# Altium schematic sheet Inductive_Leveler.SchDoc: Inductive Leveler
size A4; Author: Raúl de Pablos; CompanyName: bq - Mundo Reader; Organization: bq - Mundo Reader; DocumentNumber: 1; Revision: 1.1; SheetNumber: 1; SheetTotal: 1
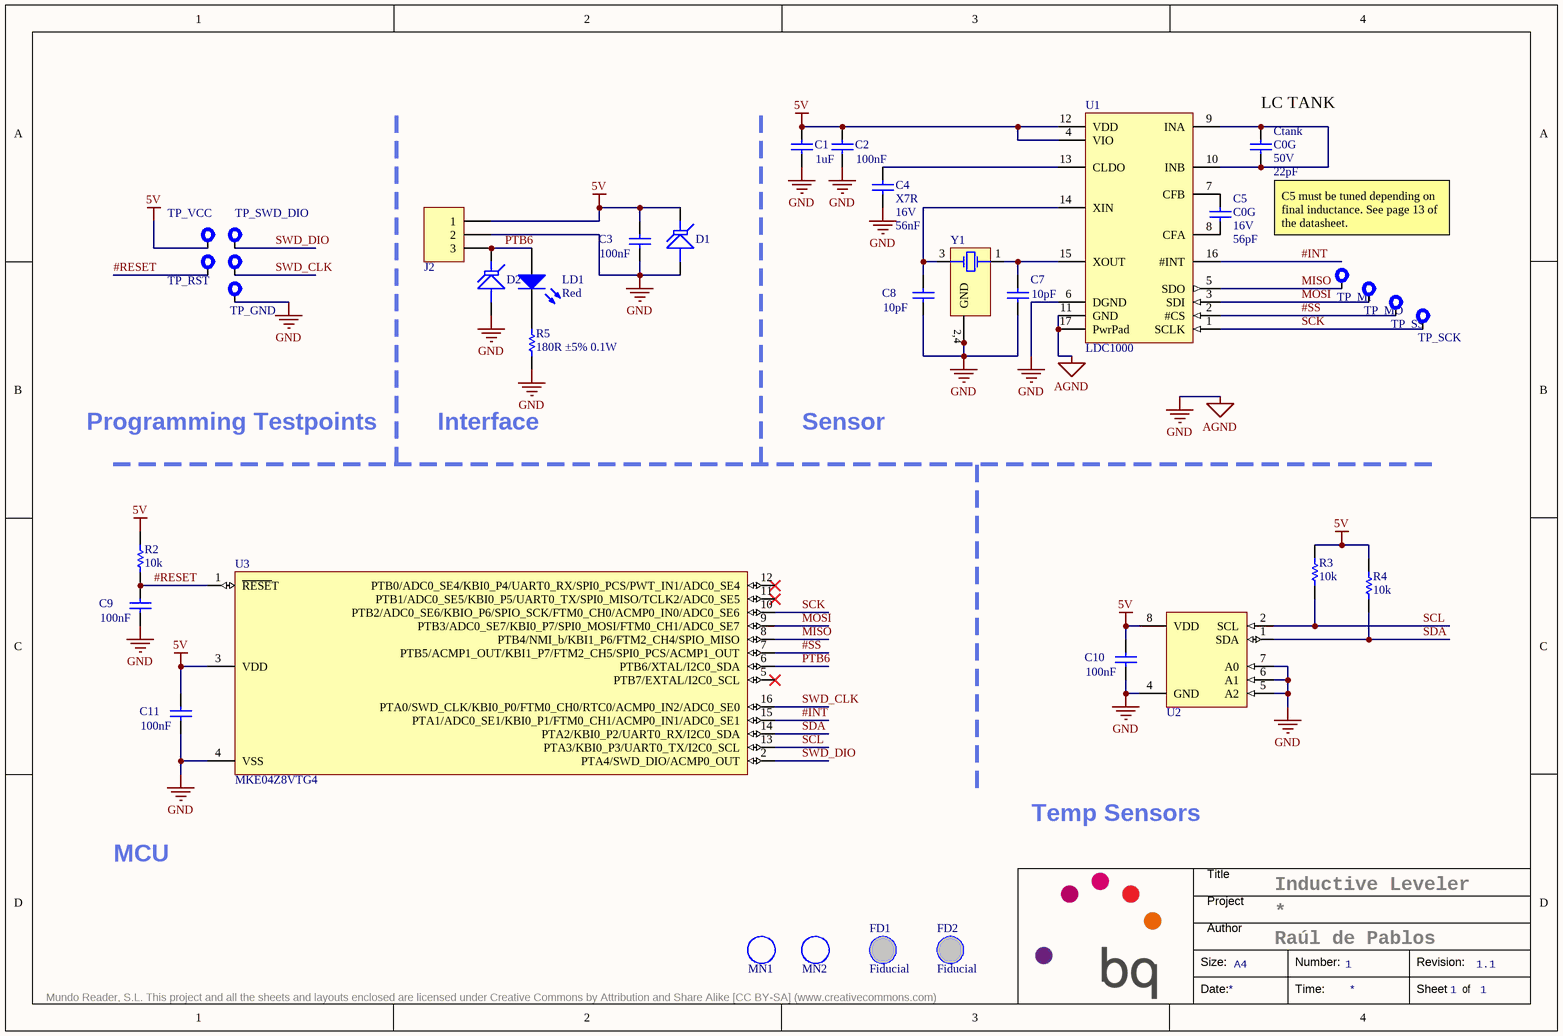
[diagram p0: Inductive_Leveler.SchDoc]

## Parts
C1  Capacitance: 1uF  [C0402]  (hidden comment: Capacitor)
C2  Capacitance: 100nF  [C0402]  (hidden comment: Capacitor)
C3  Capacitance: 100nF  [C0402]  (hidden comment: Capacitor)
C4  Dielectric: X7R  Voltage: 16V  Capacitance: 56nF  [C0402]  (hidden comment: Capacitor)
C5  Dielectric: C0G  Voltage: 16V  Capacitance: 56pF  [C0603]  (hidden comment: Capacitor)
C7  Capacitance: 10pF  [C0402]  (hidden comment: Capacitor)
C8  Capacitance: 10pF  [C0402]  (hidden comment: Capacitor)
C9  Capacitance: 100nF  [C0402]  (hidden comment: Capacitor)
C10  Capacitance: 100nF  [C0402]  (hidden comment: Capacitor)
C11  Capacitance: 100nF  [C0402]  (hidden comment: Capacitor)
Ctank  Dielectric: C0G  Voltage: 50V  Capacitance: 22pF  [C0603]  (hidden comment: Capacitor)
D1  ESD9L5.0ST5G  [SOD923]  (value not drawn)
D2  ESD9L5.0ST5G  [SOD923]  (value not drawn)
FD1  Fiducial  [Fiducial_1mm]  (no BOM)
FD2  Fiducial  [Fiducial_1mm]  (no BOM)
J2  1x3 pin Header 2.54mm  [1x3 Header Angled SMD 2.54]  (value not drawn)
LD1  Red  [LED0603]
MN1  Mounting Nut  [SMTSO-M4-4ET]  (value not drawn)
MN2  Mounting Nut  [SMTSO-M4-4ET]  (value not drawn)
R2  value 10k  [R0402]  (hidden comment: Resistor)
R3  value 10k  [R0402]  (hidden comment: Resistor)
R4  value 10k  [R0402]  (hidden comment: Resistor)
R5  value 180R ±5% 0.1W  [R0603]  (hidden comment: Resistor)
TP_GND  Testpoint  [TP_SMD_1mm]  (value not drawn)  (no BOM)
TP_MI  Testpoint  [TP_SMD_1mm]  (value not drawn)  (no BOM)
TP_MO  Testpoint  [TP_SMD_1mm]  (value not drawn)  (no BOM)
TP_RST  Testpoint  [TP_SMD_1mm]  (value not drawn)  (no BOM)
TP_SCK  Testpoint  [TP_SMD_1mm]  (value not drawn)  (no BOM)
TP_SS  Testpoint  [TP_SMD_1mm]  (value not drawn)  (no BOM)
TP_SWD_CLK  Testpoint  [TP_SMD_1mm]  (value not drawn)  (no BOM)
TP_SWD_DIO  Testpoint  [TP_SMD_1mm]  (value not drawn)  (no BOM)
TP_VCC  Testpoint  [TP_SMD_1mm]  (value not drawn)  (no BOM)
U1  LDC1000  [LDC1000]
U2  TCN75A  [MSOP8]  (value not drawn)
U3  MKE04Z8VTG4  [TSSOP16]
Y1  ABM3B-8.000MHZ-B2-T  [XTAL 5X3.2mm_alternate]  (value not drawn)

## Nets
5V: C1.2 C2.2 C3.2 C10.2 C11.2 D1.K J2.1 R2.2 R3.2 R4.2 TP_VCC.1 U1.4(VIO) U1.12(VDD) U2.8(VDD) U3.3(VDD)
AGND: C1.1 C2.1 C3.1 C4.1 C7.1 C8.1 C9.1 C10.1 C11.1 D1.A D2.A J2.2 R5.1 TP_GND.1 U1.6(DGND) U1.11(GND) U1.17(PwrPad) U2.4(GND) U2.5(A2) U2.6(A1) U2.7(A0) U3.4(VSS) Y1.2(GND) Y1.4(GND)  [also labelled GND]
#INT: U1.16(#INT) U3.15(PTA1/ADC0_SE1/KBI0_P1/FTM0_CH1/ACMP0_IN1/ADC0_SE1)
#RESET: C9.2 R2.1 TP_RST.1 U3.1(~{RESE}T)
#SS: TP_SS.1 U1.2(#CS) U3.7(PTB5/ACMP1_OUT/KBI1_P7/FTM2_CH5/SPI0_PCS/ACMP1_OUT)
MISO: TP_MI.1 U1.5(SDO) U3.8(PTB4/NMI_b/KBI1_P6/FTM2_CH4/SPIO_MISO)
MOSI: TP_MO.1 U1.3(SDI) U3.9(PTB3/ADC0_SE7/KBI0_P7/SPI0_MOSI/FTM0_CH1/ADC0_SE7)
PTB6: D2.K J2.3 LD1.A U3.6(PTB6/XTAL/I2C0_SDA)
SCK: TP_SCK.1 U1.1(SCLK) U3.10(PTB2/ADC0_SE6/KBIO_P6/SPIO_SCK/FTM0_CH0/ACMP0_IN0/ADC0_SE6)
SCL: R3.1 U2.2(SCL) U3.13(PTA3/KBI0_P3/UART0_TX/I2C0_SCL)
SDA: R4.1 U2.1(SDA) U3.14(PTA2/KBI0_P2/UART0_RX/I2C0_SDA)
SWD_CLK: TP_SWD_CLK.1 U3.16(PTA0/SWD_CLK/KBI0_P0/FTM0_CH0/RTC0/ACMP0_IN2/ADC0_SE0)
SWD_DIO: TP_SWD_DIO.1 U3.2(PTA4/SWD_DIO/ACMP0_OUT)
NetC4_2: C4.2 U1.13(CLDO)
NetC5_1: C5.1 U1.8(CFA)
NetC5_2: C5.2 U1.7(CFB)
NetC7_2: C7.2 U1.15(XOUT) Y1.1(OSC1)
NetC8_2: C8.2 U1.14(XIN) Y1.3(OSC2)
NetCtank_1: Ctank.1 Ctank.2 U1.9(INA) U1.10(INB)
NetLD1_K: LD1.K R5.2

Not connected (* = marked no-connect by the designer): U3 5(PTB7/EXTAL/I2C0_SCL)* 11(PTB1/ADC0_SE5/KBI0_P5/UART0_TX/SPI0_MISO/TCLK2/ADC0_SE5)* 12(PTB0/ADC0_SE4/KBI0_P4/UART0_RX/SPI0_PCS/PWT_IN1/ADC0_SE4)*

## Notes on the sheet
- (near Ctank) LC TANK
- C5 must be tuned depending on final inductance. See page 13 of the datasheet.
- Programming Testpoints
- Interface
- Sensor
- Temp Sensors
- MCU
- Title
- Project
- Size:
- Author
- A4
- Number:
- Revision:
- Mundo Reader, S.L. This project and all the sheets and layouts enclosed are licensed under Creative Commons by Attribution and Share Alike [CC BY-SA] (www.creativecommons.com)
- Date:
- Time:
- Sheet
- of
- (in symbol ABM3B 8MHz) 2,4

## Library data of the parts
C1 = C0402_1uF_16V_±10%: Capacitor SMD; Manufacturer: TDK; Tolerance: ±10%; OrderingCode: C1005X5R1C105K050BC; Temp_ Max: 125; Temp_ Min: -55; Value: =Capacitance+' '+Tolerance+' '+Voltage; Part Number: C0402_1uF_16V_±10%
C2 C3 C9-C11 = C0402_100nF_16V_±10%: Capacitor SMD; Manufacturer: Kemet; Tolerance: ±10%; OrderingCode: C0402C104K4RAC; Temp_ Max: 125; Temp_ Min: -55; Value: =Capacitance+' '+Tolerance+' '+Voltage; Part Number: C0402_100nF_16V_±10%
C4 = C0402_56nF_16V_±10%: Capacitor SMD; Manufacturer: Kemet; Value: 56nF ±10% 16V; Tolerance: ±10%; OrderingCode: C0402C563K4RAC; Temp_ Max: 125; Temp_ Min: -55; Part Number: C0402_56nF_16V_±10%
C5 = C0603_56pF_16V_±10%: Capacitor SMD; Manufacturer: Kemet; Value: 56pF ±10% 16V; Tolerance: ±10%; OrderingCode: C0603C560K4GAC; Temp_ Max: 125; Temp_ Min: -55; Part Number: C0603_56pF_16V_±10%
C7 C8 = C0402_10pF_16V_±10%: Capacitor SMD; Manufacturer: Kemet; Tolerance: ±10%; OrderingCode: C0402C100K4GAC; Temp_ Max: 125; Temp_ Min: -55; Value: =Capacitance+' '+Tolerance+' '+Voltage; Part Number: C0402_10pF_16V_±10%
Ctank = C0603_22pF_25V_±10%: Capacitor SMD; Part Number: C0603_22pF_50V_±1%; Manufacturer: AVX; Value: 22pF 1% 50V; Tolerance: 1%; OrderingCode: 06035A220FAT2A; Temp_ Max: 125; Temp_ Min: -55
D1 D2 = TVS 5Vdc Low Cap: Protection, Transient Suppression Diode; Manufacturer: ON Semiconductor; Voltage: 5Vdc; Breakdown Voltage: 5,4Vdc; Overvoltage Current: 1A; Temp_ Max: 125; Temp_ Min: -55; Part Number: TVS 5Vdc Low Cap; OrderingCode: ESD9L5.0ST5G
FD1 FD2 = Fiducial 1mm: Fiducial Mark; Part Number: Fiducial 1mm
J2 = CON_TPH_SMDA2.54_3: Connector, 1x3 pin Header 2.54mm; Manufacturer: Samtec; OrderingCode: TSM-103-01-T-SH; Temp_ Max: 105; Temp_ Min: -55; Value: 3; Pitch: 2.54mm; Pin: 3; Part Number: CON_TPH_SMDA2.54_3
LD1 = LS Q976-NR-1: Light Emitting Diode; Manufacturer: OSRAM Opto; Temp_ Max: 85; Temp_ Min: -40; OrderingCode 2: HSMH-C190; Part Number: LS Q976-NR-1; OrderingCode: LS Q976-NR-1; Manufacturer 2: Avago Technologies; Value: Red
MN1 MN2 = SMTSO-M4-4ET: SMTSO Mounting Nut; Manufacturer: PEM; Part Number: SMTSO-M4-4ET
R2-R4 = R0402_10k_0.063W_±5%: Resistor, SMD; Manufacturer: Vishay; Tolerance: ±5%; OrderingCode: CRCW040210K0JN; Power: 0.063W; Temp_ Max: 155; Temp_ Min: -55; PackageDescription: SMD; Part Number: R0402_10k_0.063W_±5%; Resistance: 10k
R5 = R0603_180R_0.1W_±5%: Resistor, SMD; Manufacturer: Vishay; Tolerance: ±5%; OrderingCode: CRCW0603180RJN; Power: 0.1W; Resistance: 180R; Temp_ Max: 155; Temp_ Min: -55; PackageDescription: SMD; Part Number: R0603_180R_0.1W_±5%
TP_GND TP_MI TP_MO TP_RST TP_SCK TP_SS TP_SWD_CLK TP_SWD_DIO TP_VCC = TP_SMD_1mm: Manufacturer: Oxley; OrderingCode: SMOX/060/B1; SAP: 303552; Part Number: TP_SMD_1mm
U1 = Inductive Sensor: Sensor, Inductance; Manufacturer: Texas Instruments; Temp_ Max: 125; Temp_ Min: -40; Part Number: Inductive Sensor; OrderingCode: LDC1000
U2 = TCN75A: SENSOR TEMP; Manufacturer: Microchip; OrderingCode: TCN75AVUA; Temp_ Max: 125; Temp_ Min: -40; Part Number: TCN75A
U3 = MKE04Z8VTG4: Processor, 32-bit microcontroller; Manufacturer: Freescale; Temp_ Max: 105; Temp_ Min: -40; Part Number: MKE04Z8VTG4; OrderingCode: MKE04Z8VTG4
Y1 = ABM3B 8MHz: Crystal 4 pin; Manufacturer: Abracon; Tolerance: ±20ppm; Load Capacitance: 18pF; Temp_ Max: 70; Temp_ Min: -20; Value: 8MHz; Part Number: ABM3B 8MHz; OrderingCode: ABM3B-8.000MHZ-B2-T